# EAGLE design vasttrapi_pmu (EAGLE 8.1.1)
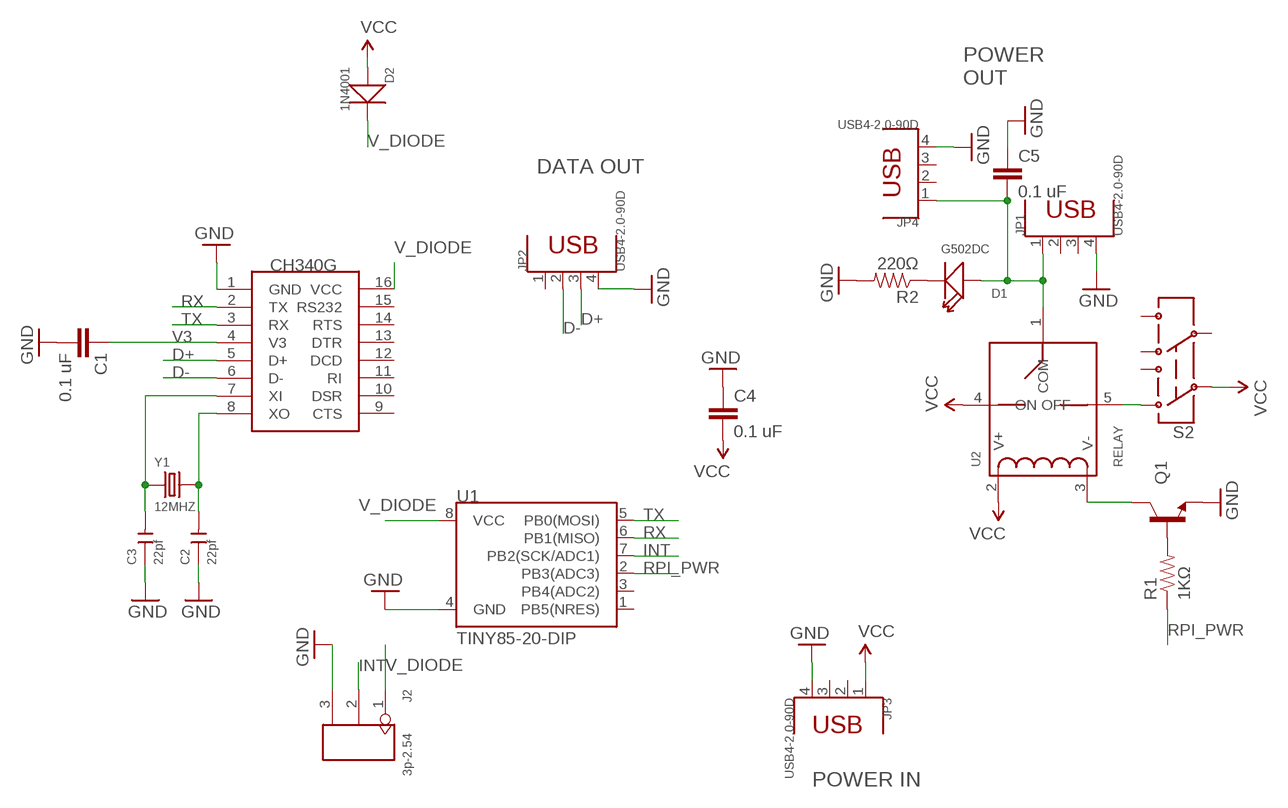
[diagram p0: schematic, sheet 1]

## Parts
C1  0.1 uF  0.1UF-50V-20%(PTH)KIT-EZ  [CAP-PTH-SMALL-KIT]
C2  22pf  DIP-CERAMIC-22PF-100V-5%-NPO(D5.0MM)  [CERAMIC-2.54]
C3  22pf  DIP-CERAMIC-22PF-100V-5%-NPO(D5.0MM)  [CERAMIC-2.54]
C4  0.1 uF  0.1UF-50V-20%(PTH)KIT-EZ  [CAP-PTH-SMALL-KIT]
C5  0.1 uF  0.1UF-50V-20%(PTH)KIT-EZ  [CAP-PTH-SMALL-KIT]
D1  G502DC  DIP-LED-GREEN-GREEN(2P-D5MM)  [LED2-2.54-D5.0MM]
D2  1N4001  DIP-DIODE-50V-1A-1N4001(DO-41)  [DO-41]
J2  3p-2.54  DIP-BLACK-FEMALE-HEADER-VERT(3P-2.54)  [H3-2.54]
JP1  USB4-2.0-90D  DIP-USB-A-TYPE-FMAL(4+2P-2.0-90D)  [USB4+2P-2.0-90D]
JP2  USB4-2.0-90D  DIP-USB-A-TYPE-FMAL(4+2P-2.0-90D)  [USB4+2P-2.0-90D]
JP3  USB4-2.0-90D  DIP-USB-A-TYPE-FMAL(4+2P-2.0-90D)  [USB4+2P-2.0-90D]
JP4  USB4-2.0-90D  DIP-USB-A-TYPE-FMAL(4+2P-2.0-90D)  [USB4+2P-2.0-90D]
Q1  TRANSISTOR_NPNBC547  [TO-92-AMMO]
R1  1KΩ  RESISTORPTH-1/4W  [AXIAL-0.4]
R2  220Ω  RESISTORPTH-1/4W  [AXIAL-0.4]
S2  SWITCH-DPDTOS  [OS]
U1  TINY85-20-DIP  ATTINY45TINY85-20-DIP  [DIP08]
U2  RELAY  [RELAY]
U$1  CH340G  [SOIC16]
Y1  12MHZ  DIP-CRYSTAL-16MHZ-18PF-30PPM-40R(HC49US)  [HC49US]

## Nets
D+: JP2.3 U$1.5(D+)
D-: JP2.2 U$1.6(D-)
GND: C1.2 C2.1 C3.1 C4.1 C5.1 J2.3 JP1.4 JP2.4 JP3.4 JP4.4 Q1.3(E) R2.P$2 U1.4(GND) U$1.1(GND)
INT: J2.2 U1.7(PB2(SCK/ADC1))
N$1: Q1.2(B) R1.P$2
N$2: Q1.1(C) U2.3(V-)
N$3: S2.1 U2.5(OFF)
N$4: C2.2 U$1.8(XO) Y1.2
N$5: C3.2 U$1.7(XI) Y1.1
N$6: D1.- R2.P$1
RPI_PWR: R1.P$1 U1.2(PB3(ADC3))
RX: U1.6(PB1(MISO)) U$1.2(TX)
TX: U1.5(PB0(MOSI)) U$1.3(RX)
V3: C1.1 U$1.4(V3)
V_DIODE: D2.2(-) J2.1 U1.8(VCC) U$1.16(VCC)
VCC: C4.2 D2.1(+) JP3.1 S2.2 U2.2(V+) U2.4(ON)
VRPI: C5.2 D1.+ JP1.1 JP4.1 U2.1(COM)
Unconnected: JP1.2 JP1.3 JP1.SG1(GND) JP1.SG2(GND) JP2.1 JP2.SG1(GND) JP2.SG2(GND) JP3.2 JP3.3 JP3.SG1(GND) JP3.SG2(GND) JP4.2 JP4.3 JP4.SG1(GND) JP4.SG2(GND) S2.3 S2.4 S2.5 S2.6 U1.1(PB5(NRES)) U1.3(PB4(ADC2)) U$1.9(CTS) U$1.10(DSR) U$1.11(RI) U$1.12(DCD) U$1.13(DTR) U$1.14(RTS) U$1.15(RS232)

## Notes on the sheet
- POWER
  OUT
- DATA OUT
- POWER IN

## Library data of the parts
C1 C4 C5 = SparkFun-Capacitors:0.1UF-50V-20%(PTH): CAP-08370; PROD_ID: CAP-08370
C2 C3 = Seeed-OPL-Capacitor:DIP-CERAMIC-22PF-100V-5%-NPO(D5.0MM): 302010197; MPN: CT4-0805CG220J101F3
D1 = Seeed-OPL-Diode:DIP-LED-GREEN-GREEN(2P-D5MM): 304090038; MPN: G502DC
D2 = Seeed-OPL-Diode:DIP-DIODE-50V-1A-1N4001(DO-41): 304010006; MPN: 1N4001
J2 = Seeed-OPL-Connector:DIP-BLACK-FEMALE-HEADER-VERT(3P-2.54): 320030024; MPN: F185-1103A0BSYA1
JP1-JP4 = Seeed-OPL-Connector:DIP-USB-A-TYPE-FMAL(4+2P-2.0-90D): 320010007
Q1 = SparkFun-DiscreteSemi:TRANSISTOR_NPN: Generic NPN BJT MMBT2222A - TRANS-08049 (SOT-23, 1A 40V) MPSA42 - TRANS-09116 (SOT-23, 500mA 300V) MMBT5088LT1G - TRANS-11160 (SOT-23, 50 mA 30V) BC547 - COM-08928 <http://www.sparkfun.com/products/8928> (TO-92 45V 100mA) (1.Collector 2.Base 3.Emitter) 2N3904 - COM-00521 <http://www.sparkfun.com/products/521> (TO-92 40V 200mA) (1.Emitter 2.Base 3.Collector) P2N2222A - COM-12852 <http://www.sparkfun.com/products/12852> (TO-92 40V 600mA) (1.Collector 2.Base 3.Emitter)
R1 R2 = SparkFun-Passives:RESISTOR: Resistor Basic schematic elements and footprints for 0603, 1206, and PTH resistors.
S2 = SparkFun-Electromechanical:SWITCH-DPDT: DPDT Version of the COM-00597
U1 = SparkFun-DigitalIC:ATTINY45: Atmel 8-pin 2/4/8kB flash uC; PROD_ID: IC-09445
U2 = Itead_BP_110825.lbr:RELAY: BAS003
U$1 = ch340g:CH340G
Y1 = Seeed-OPL-Crystal-Oscillator:DIP-CRYSTAL-16MHZ-18PF-30PPM-40R(HC49US): 306010014; MPN: HC-49US 16.000MHz; VALUE: 16MHZ

## Board
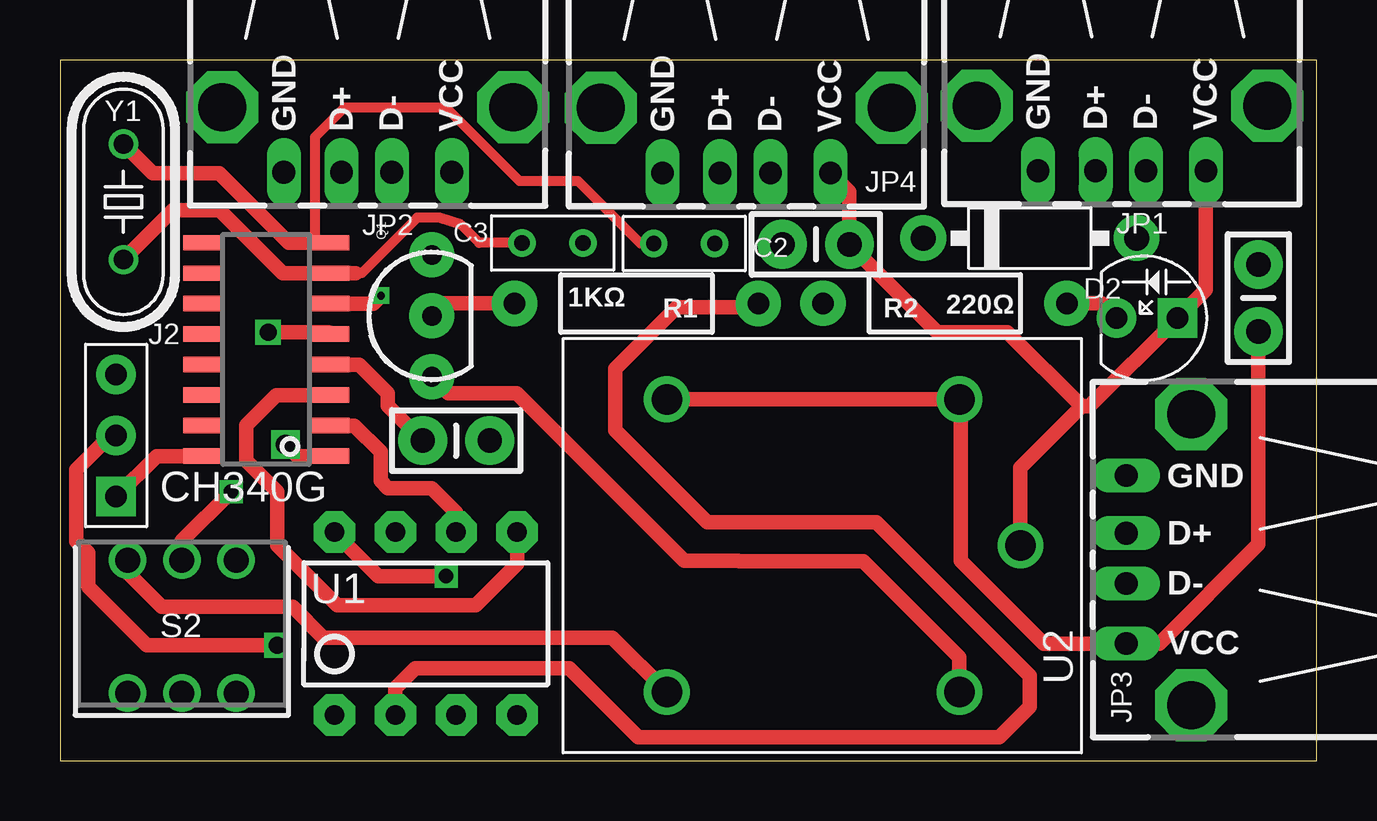
[diagram p1: board, top side]
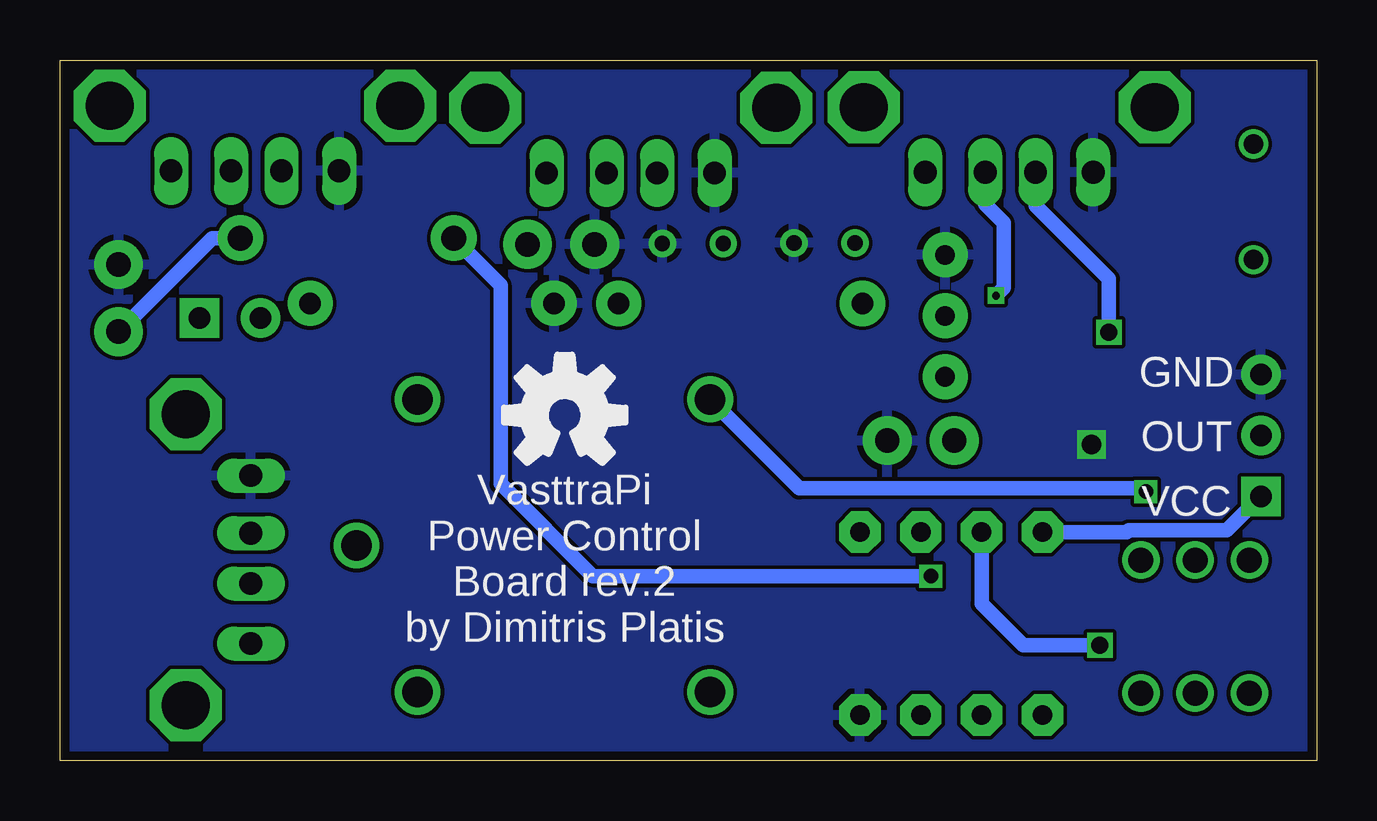
[diagram p2: board, bottom side, seen from below]

Size 52.37 x 29.2 mm. Coordinates in mm from the lower left corner, seen from the top.
Outline: 0,0 52.37,0 52.37,29.2 0,29.2 0,0
Copper layers (1*16): Top 0.0356mm / dielectric 1.5011mm / Bottom 0.0356mm
Design rules "LaenPCBOrder": minimum track width 6mil, minimum drill 13mil, track to track 6mil, track to pad 6mil, pad to pad 6mil, via to via 6mil, smd to smd 6mil, copper to edge 15mil, drill to drill 6mil, minimum pad ring 7mil, minimum via ring 7mil, stop-mask expansion 3mil, vias tented up to drill 0mil, thermal gap 10mil

### Footprints (pad centres in the part's own frame; a part is rotated, then mirrored left to right if it is on the bottom)
CAP-PTH-SMALL-KIT = drill 1.016 pad 2.032: 1 -1.397,0; 2 1.397,0
CERAMIC-2.54 = drill 0.635 pad 1.143: 1 -1.27,0; 2 1.27,0
LED2-2.54-D5.0MM = drill 0.889 pad 1.651 square: + -1.27,0 | drill 0.889 pad 1.651: - 1.27,0
DO-41 = drill 1.041 pad 1.905: 1 -4.445,0; 2 4.445,0
H3-2.54 = drill 0.889 pad 1.651 square: 1 0,2.54 | drill 0.889 pad 1.651: 2 0,0; 3 0,-2.54
USB4+2P-2.0-90D = drill 0.95 long: 1 -3.5,2.71; 2 -1,2.71; 3 1.102,2.71; 4 3.5,2.71 | drill 2 octagon: SG1 -6.062,0; SG2 6.062,0
TO-92-AMMO = drill 0.813 pad 1.88: 1 -2.54,0; 2 0,0; 3 2.54,0
AXIAL-0.4 = drill 0.9 pad 1.88: P$1 -5.08,0; P$2 5.08,0
OS = drill 1.041 pad 1.473: 1 -2.261,2.645; 2 0,2.645; 3 2.261,2.645; 4 -2.261,-2.899; 5 0,-2.899; 6 2.261,-2.899
DIP08 = drill 0.813 pad 1.727 octagon: 1 -3.81,-3.81; 2 -1.27,-3.81; 3 1.27,-3.81; 4 3.81,-3.81; 5 3.81,3.81; 6 1.27,3.81; 7 -1.27,3.81; 8 -3.81,3.81
RELAY = drill 1.27: 1 -2.54,-6.096; 2 0,-12.192; 3 0,0; 4 12.192,-12.192; 5 12.192,0
SOIC16 = smd 0.635 x 1.524: 1 -4.445,-2.695; 2 -3.175,-2.695; 3 -1.905,-2.695; 4 -0.635,-2.695; 5 0.635,-2.695; 6 1.905,-2.695; 7 3.175,-2.695; 8 4.445,-2.695; 9 4.445,2.695; 10 3.175,2.695; 11 1.905,2.695; 12 0.635,2.695; 13 -0.635,2.695; 14 -1.905,2.695; 15 -3.175,2.695; 16 -4.445,2.695
HC49US = drill 0.813: 1 -2.413,0; 2 2.413,0

### Placement (x,y rotation side)
C1  16.51,13.34 0 top
C2  26.01,21.55 180 top
C3  20.52,21.58 180 top
C4  49.94,19.28 270 top
C5  31.5,21.52 0 top
D1  45.29,18.44 180 top
D2  40.41,21.78 180 top
J2  2.34,13.55 180 top
JP1  44.25,27.29 180 top
JP2  12.83,27.23 180 top
JP3  47.13,8.38 90 top
JP4  28.6,27.2 180 top
Q1  15.49,18.54 90 top
R1  24.02,19.06 180 top
R2  36.87,19.06 180 top
S2  5.08,5.71 0 top
U1  15.24,5.71 0 top
U2  37.48,2.87 180 top
U$1  8.59,17.15 90 top
U$3  [OSHWLOGO_BACK_0.2]  31.34,14.4 0 top
Y1  2.64,23.29 90 top

### Tracks (layer width: path | path; a pad name or v marks a point on that pad's centre or on a via)
D+  (via drill 0.7 pad 1.02)
  Top 0.61: U$1.5 11.2,17.86 v8.67,17.86
  Bottom 0.61: JP2.3 11.73,23.13 8.67,20.08 v8.67,17.86
D-  (via drill 0.33 pad 0.61)
  Top 0.61: v13.38,19.38 13.05,19.05 U$1.6
  Bottom 0.61: JP2.2 13.83,23.2 13.06,22.43 13.06,19.7 v13.38,19.38
GND  (via drill 0.8)
  Top 0.61: U$1.1 9.88,12.7 v9.4,13.18
  pour Bottom: -0.15,29.49 52.27,29.49 52.58,-0.33 -0.15,-0.33
INT  (via drill 0.7 pad 1.02)
  Top 0.61: J2.2 2.1,13.55 0.69,12.14 0.69,9.14 1.17,8.66 1.17,7.25 3.61,4.82 v9.05,4.82
  Bottom 0.61: U1.7 13.97,6.54 12.25,4.82 v9.05,4.82
N$1
  Top 0.61: R1.P$2 16.01,19.06 Q1.2
N$2
  Top 0.61: Q1.1 16.18,15.32 19.03,15.32 26.01,8.34 28.27,8.34 28.3,8.31 33.48,8.31 37.47,4.31 U2.3
N$3
  Top 0.61: U2.5 23.02,5.14 10.97,5.14 9.69,6.42 4.25,6.42 2.82,7.84 S2.1
N$4
  Top 0.406: C2.2 24.19,21.55 21.59,24.16 19.15,24.16 16.1,27.2 11.84,27.2 10.62,25.98 10.62,21.59
  Top 0.61: U$1.8 10.62,21.59 9.52,21.59 6.63,24.49 3.86,24.49 Y1.2
N$5
  Top 0.406: C3.2 17.46,21.58 16.71,22.33 15.8,22.63 14.88,22.63 12.57,20.32 11.84,20.32
  Top 0.61: Y1.1 4.7,22.94 6.65,22.94 9.27,20.32 U$1.7 11.84,20.32 12.32,20.32
N$6
  Top 0.61: R2.P$1 43.41,19.06 D1.-
RPI_PWR
  Top 0.61: U1.2 13.97,3.02 14.81,3.86 21.21,3.86 23.13,1.94 | 23.13,1.94 | 23.13,1.94 24.09,0.98 39.13,0.98 40.41,2.26 40.41,3.54 34.01,9.94 26.97,9.94 23.13,13.78 23.13,16.34 25.69,18.9 28.94,18.9 R1.P$1
RX
  Top 0.61: U1.6 16.51,10.34 15.49,11.35 13.67,11.35 13.36,11.66 13.36,12.88 12.27,13.97 U$1.2
TX
  Top 0.61: U1.5 19.05,8.2 17.32,6.48 11.55,6.48 9.05,8.98 9.05,11.22 7.77,12.5 7.77,13.99 9.02,15.24 U$1.3
V3
  Top 0.61: C1.1 13.67,14.79 13.67,15.32 12.47,16.51 U$1.4
V_DIODE  (via drill 0.6)
  Top 0.61: v16.09,7.7 13.26,7.7 U1.8 | J2.1 4.02,12.7 U$1.16
  Bottom 0.61: D2.2 34.01,19.82 34.01,11.54 30.17,7.7 v16.09,7.7 | U1.8 7.93,9.53 7.85,9.6 3.75,9.6 J2.1
VCC  (via drill 0.6)
  Top 0.61: U2.2 37.44,15.03 | C4.2 49.94,9.02 45.8,4.89 JP3.1 40.98,4.89 37.53,8.34 37.53,15.01 U2.2 | U2.2 U2.4 | S2.2 5.08,9.17 v7.13,11.22
  Bottom 0.61: U2.4 21.57,11.35 7.26,11.35 v7.13,11.22 | C4.2 46.04,21.78 D2.1
VRPI
  Top 0.61: U2.1 40.01,12.22 42.56,14.76 | 42.56,14.76 39.47,17.86 36.56,17.86 C5.2 32.89,23.7 JP4.1 | 42.56,14.76 42.88,14.76 D1.+ 47.75,19.63 JP1.1

### Text on the board
bPlace: GND | OUT | VCC | VasttraPi / Power Control / Board rev.2 / by Dimitris Platis